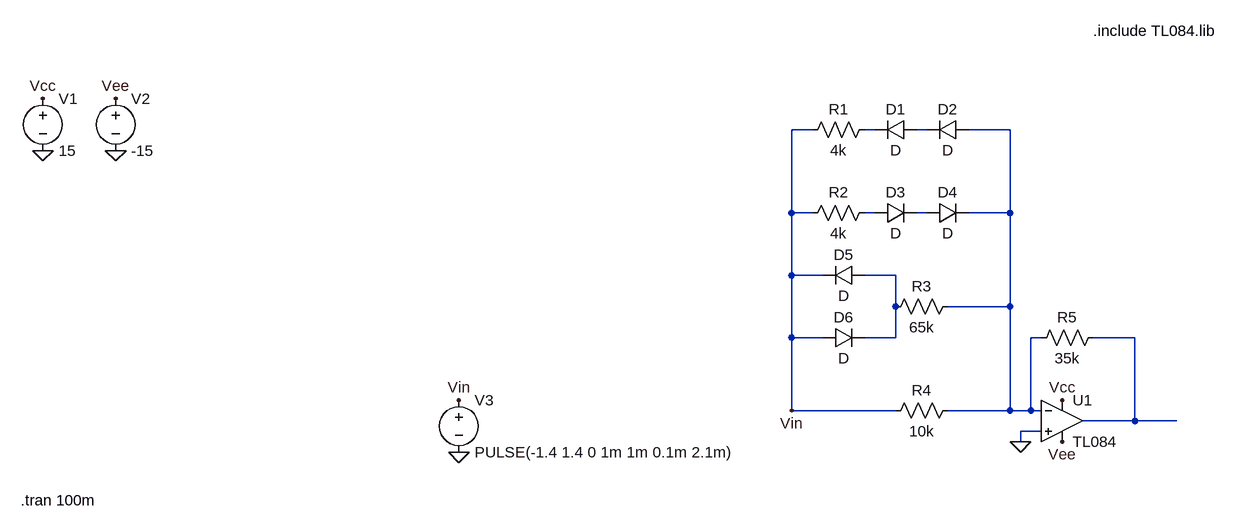
[diagram p0: schematic newArcsin.asc]
newArcsin.asc, the LTspice schematic file:
Version 4
SHEET 1 880 700
WIRE 80 112 48 112
WIRE 176 112 160 112
WIRE 256 112 240 112
WIRE 384 112 320 112
WIRE 48 240 48 112
WIRE 80 240 48 240
WIRE 176 240 160 240
WIRE 256 240 240 240
WIRE 384 240 384 112
WIRE 384 240 320 240
WIRE 48 336 48 240
WIRE 96 336 48 336
WIRE 208 336 160 336
WIRE 208 384 208 336
WIRE 384 384 384 240
WIRE 384 384 288 384
WIRE 48 432 48 336
WIRE 96 432 48 432
WIRE 208 432 208 384
WIRE 208 432 160 432
WIRE 432 432 416 432
WIRE 576 432 512 432
WIRE 48 544 48 432
WIRE 208 544 48 544
WIRE 384 544 384 384
WIRE 384 544 288 544
WIRE 416 544 416 432
WIRE 416 544 384 544
WIRE 432 544 416 544
WIRE 576 560 576 432
WIRE 576 560 496 560
WIRE 640 560 576 560
WIRE 432 576 400 576
WIRE 400 592 400 576
FLAG -992 144 0
FLAG -1104 144 0
FLAG -1104 64 Vcc
FLAG 464 528 Vcc
FLAG -992 64 Vee
FLAG 464 592 Vee
FLAG 400 592 0
FLAG -464 608 0
FLAG -464 528 Vin
FLAG 48 544 Vin
SYMBOL res 176 96 R90
WINDOW 0 0 56 VBottom 2
WINDOW 3 32 56 VTop 2
SYMATTR InstName R1
SYMATTR Value 4k
SYMBOL diode 240 96 R90
WINDOW 0 0 32 VBottom 2
WINDOW 3 32 32 VTop 2
SYMATTR InstName D1
SYMBOL diode 320 96 R90
WINDOW 0 0 32 VBottom 2
WINDOW 3 32 32 VTop 2
SYMATTR InstName D2
SYMBOL diode 176 256 R270
WINDOW 0 32 32 VTop 2
WINDOW 3 0 32 VBottom 2
SYMATTR InstName D3
SYMBOL diode 256 256 R270
WINDOW 0 32 32 VTop 2
WINDOW 3 0 32 VBottom 2
SYMATTR InstName D4
SYMBOL res 176 224 R90
WINDOW 0 0 56 VBottom 2
WINDOW 3 32 56 VTop 2
SYMATTR InstName R2
SYMATTR Value 4k
SYMBOL diode 160 320 R90
WINDOW 0 0 32 VBottom 2
WINDOW 3 32 32 VTop 2
SYMATTR InstName D5
SYMBOL diode 96 448 R270
WINDOW 0 32 32 VTop 2
WINDOW 3 0 32 VBottom 2
SYMATTR InstName D6
SYMBOL res 304 368 R90
WINDOW 0 0 56 VBottom 2
WINDOW 3 32 56 VTop 2
SYMATTR InstName R3
SYMATTR Value 65k
SYMBOL res 304 528 R90
WINDOW 0 0 56 VBottom 2
WINDOW 3 32 56 VTop 2
SYMATTR InstName R4
SYMATTR Value 10k
SYMBOL Opamps\\opamp2 464 496 R0
SYMATTR InstName U1
SYMATTR Value TL084
SYMBOL voltage -1104 48 R0
WINDOW 123 0 0 Left 0
WINDOW 39 0 0 Left 0
SYMATTR InstName V1
SYMATTR Value 15
SYMBOL voltage -992 48 R0
WINDOW 123 0 0 Left 0
WINDOW 39 0 0 Left 0
SYMATTR InstName V2
SYMATTR Value -15
SYMBOL voltage -464 512 R0
WINDOW 123 0 0 Left 0
WINDOW 39 0 0 Left 0
SYMATTR InstName V3
SYMATTR Value PULSE(-1.4 1.4 0 1m 1m 0.1m 2.1m)
SYMBOL res 528 416 R90
WINDOW 0 0 56 VBottom 2
WINDOW 3 32 56 VTop 2
SYMATTR InstName R5
SYMATTR Value 35k
TEXT 512 -40 Left 2 !.include TL084.lib
TEXT -1138 682 Left 2 !.tran 100m

The netlist it stands for:
* newArcsin.asc
R1 N001 Vin 4k
D1 N002 N001 D
D2 N003 N002 D
D3 N004 N005 D
D4 N005 N003 D
R2 N004 Vin 4k
D5 N006 Vin D
D6 Vin N006 D
R3 N003 N006 65k
R4 N003 Vin 10k
XU1 0 N003 Vcc Vee N007 TL084  ; pins In+ In- V+ V- OUT
V1 Vcc 0 15
V2 Vee 0 -15
V3 Vin 0 PULSE(-1.4 1.4 0 1m 1m 0.1m 2.1m)
R5 N007 N003 35k
.model D D
.lib standard.dio
.include TL084.lib
.tran 100m
.backanno
.end